# EAGLE design v2560 (EAGLE 7.6.0)
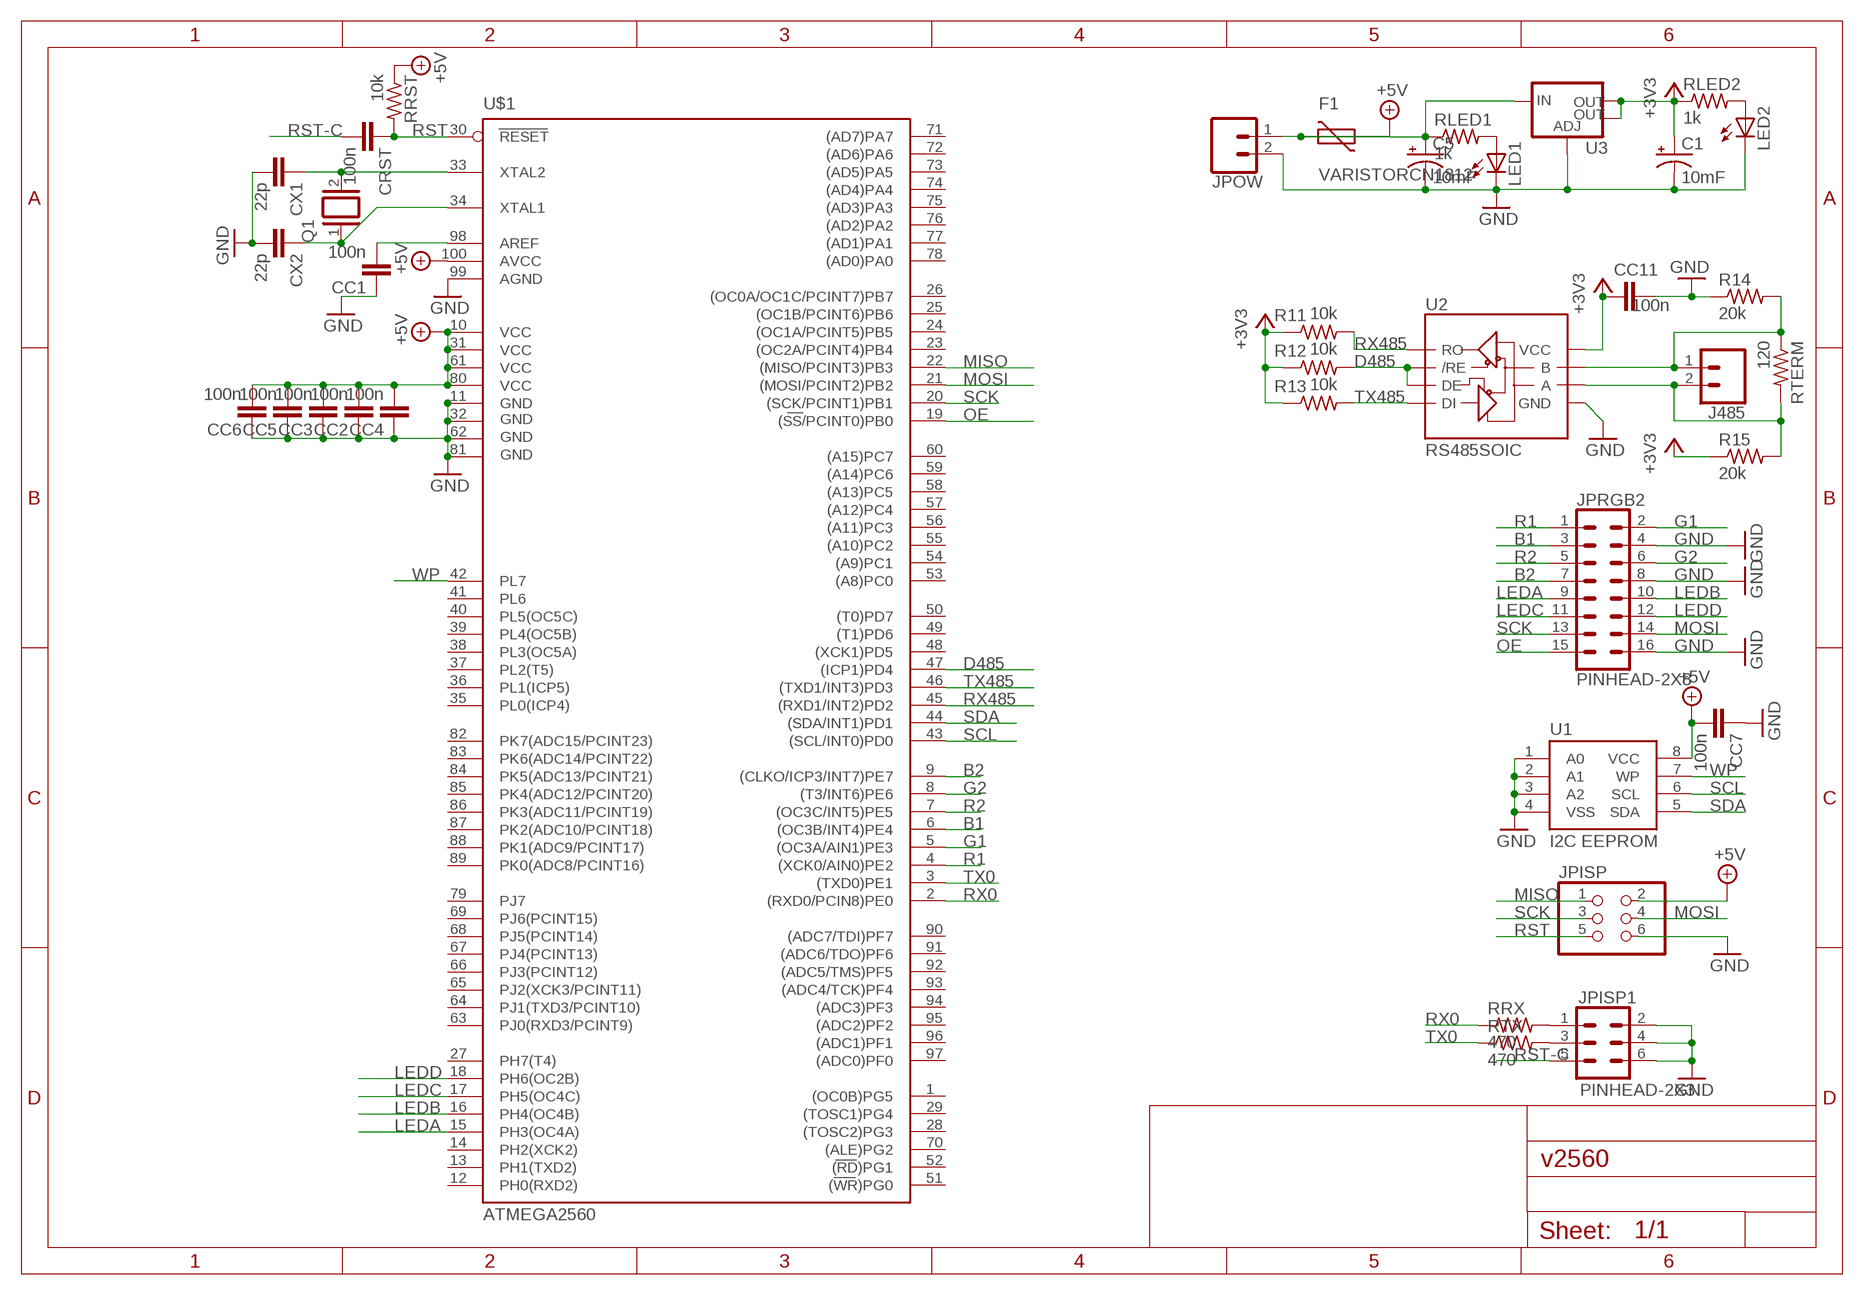
[diagram p0: schematic, sheet 1]

## Parts
C1  10mF  1000UF-RADIAL-5MM-25V-20%  [CPOL-RADIAL-5MM-10MM]
C5  10mF  1000UF-RADIAL-5MM-25V-20%  [CPOL-RADIAL-5MM-10MM]
CC1  100n  CAP-NPOL_C0805  [C0805]
CC2  100n  CAP-NPOL_C0805  [C0805]
CC3  100n  CAP-NPOL_C0805  [C0805]
CC4  100n  CAP-NPOL_C0805  [C0805]
CC5  100n  CAP-NPOL_C0805  [C0805]
CC6  100n  CAP-NPOL_C0805  [C0805]
CC7  100n  CAP-NPOL_C0805  [C0805]
CC11  100n  CAP-NPOL_C0805  [C0805]
CRST  100n  CAP-NPOL_C0805  [C0805]
CX1  22p  CAP-NPOL_C0805  [C0805]
CX2  22p  CAP-NPOL_C0805  [C0805]
F1  VARISTORCN1812  [CT/CN1812]
J485  CONN_025MM  [SCREWTERMINAL-5MM-2]
JPISP  PINHD-2X3  [2X03]
JPISP1  PINHEAD-2X3  [2X03-LOCK]
JPOW  CONN_025MM  [SCREWTERMINAL-5MM-2]
JPRGB2  PINHEAD-2X8  [2X08-LOCK]
LED1  LED3MM  [LED3MM]
LED2  LED3MM  [LED3MM]
Q1  XTAL/S  [QS]
R11  10k  RES_R0805  [R0805]
R12  10k  RES_R0805  [R0805]
R13  10k  RES_R0805  [R0805]
R14  20k  RES_TH3  [RES-0.3]
R15  20k  RES_TH3  [RES-0.3]
RLED1  1k  RES_R0805  [R0805]
RLED2  1k  RES_R0805  [R0805]
RRST  10k  RES_R0805  [R0805]
RRX  470  RES_R0805  [R0805]
RTERM  120  RES_R0805  [R0805]
RTX  470  RES_R0805  [R0805]
U1  I2C EEPROM  EEPROM-I2CEIAJ  [SO08-EIAJ]
U2  RS485SOIC  [SO08]
U3  V_REG_LM1117SOT223  [SOT223]
U$1  ATMEGA2560  [TQFP100]

## Nets
+3V3: C1.+ CC11.2 R11.1 R12.1 R13.1 R15.1 RLED2.1 U2.8(VCC) U3.2(OUT) U3.4(OUT)
+5V: C5.+ CC2.2 CC3.2 CC4.2 CC5.2 CC6.2 CC7.2 F1.2 JPISP.2 RLED1.1 RRST.1 U1.8(VCC) U3.3(IN) U$1.10(VCC) U$1.31(VCC1) U$1.61(VCC2) U$1.80(VCC3) U$1.100(AVCC)
AREF: CC1.2 U$1.98(AREF)
B1: JPRGB2.3 U$1.6((OC3B/INT4)PE4)
B2: JPRGB2.7 U$1.9((CLKO/ICP3/INT7)PE7)
D485: R12.2 U2.2(/RE) U2.3(DE) U$1.47((ICP1)PD4)
G1: JPRGB2.2 U$1.5((OC3A/AIN1)PE3)
G2: JPRGB2.6 U$1.8((T3/INT6)PE6)
GND: C1.- C5.- CC1.1 CC2.1 CC3.1 CC4.1 CC5.1 CC6.1 CC7.1 CC11.1 CX1.2 CX2.2 JPISP1.2 JPISP1.4 JPISP1.6 JPISP.6 JPOW.2 JPRGB2.4 JPRGB2.8 JPRGB2.16 LED1.K(C) LED2.K(C) R14.1 U1.1(A0) U1.2(A1) U1.3(A2) U1.4(VSS) U2.5(GND) U3.1(ADJ) U$1.11(GND) U$1.32(GND1) U$1.62(GND2) U$1.81(GND3) U$1.99(AGND)
LEDA: JPRGB2.9 U$1.15(PH3(OC4A))
LEDB: JPRGB2.10 U$1.16(PH4(OC4B))
LEDC: JPRGB2.11 U$1.17(PH5(OC4C))
LEDD: JPRGB2.12 U$1.18(PH6(OC2B))
MISO: JPISP.1 U$1.22((MISO/PCINT3)PB3)
MOSI: JPISP.4 JPRGB2.14 U$1.21((MOSI/PCINT2)PB2)
N$2: J485.2 R15.2 RTERM.2 U2.6(A)
N$5: CX1.1 Q1.2 U$1.33(XTAL2)
N$6: CX2.1 Q1.1 U$1.34(XTAL1)
N$8: LED1.A RLED1.2
N$10: LED2.A RLED2.2
N$11: J485.1 R14.2 RTERM.1 U2.7(B)
N$12: F1.1 JPOW.1
N$14: JPISP1.3 RTX.2
N$15: JPISP1.1 RRX.2
OE: JPRGB2.15 U$1.19((SS/PCINT0)PB0)
R1: JPRGB2.1 U$1.4((XCK0/AIN0)PE2)
R2: JPRGB2.5 U$1.7((OC3C/INT5)PE5)
RST: CRST.1 JPISP.5 RRST.2 U$1.30(RESET)
RST-C: CRST.2 JPISP1.5
RX0: RRX.1 U$1.2((RXD0/PCIN8)PE0)
RX485: R11.2 U2.1(RO) U$1.45((RXD1/INT2)PD2)
SCK: JPISP.3 JPRGB2.13 U$1.20((SCK/PCINT1)PB1)
SCL: U1.6(SCL) U$1.43((SCL/INT0)PD0)
SDA: U1.5(SDA) U$1.44((SDA/INT1)PD1)
TX0: RTX.1 U$1.3((TXD0)PE1)
TX485: R13.2 U2.4(DI) U$1.46((TXD1/INT3)PD3)
WP: U1.7(WP) U$1.42(PL7)
Unconnected: U$1.1((OC0B)PG5) U$1.12(PH0(RXD2)) U$1.13(PH1(TXD2)) U$1.14(PH2(XCK2)) U$1.23((OC2A/PCINT4)PB4) U$1.24((OC1A/PCINT5)PB5) U$1.25((OC1B/PCINT6)PB6) U$1.26((OC0A/OC1C/PCINT7)PB7) U$1.27(PH7(T4)) U$1.28((TOSC2)PG3) U$1.29((TOSC1)PG4) U$1.35(PL0(ICP4)) U$1.36(PL1(ICP5)) U$1.37(PL2(T5)) U$1.38(PL3(OC5A)) U$1.39(PL4(OC5B)) U$1.40(PL5(OC5C)) U$1.41(PL6) U$1.48((XCK1)PD5) U$1.49((T1)PD6) U$1.50((T0)PD7) U$1.51((WR)PG0) U$1.52((RD)PG1) U$1.53((A8)PC0) U$1.54((A9)PC1) U$1.55((A10)PC2) U$1.56((A11)PC3) U$1.57((A12)PC4) U$1.58((A13)PC5) U$1.59((A14)PC6) U$1.60((A15)PC7) U$1.63(PJ0(RXD3/PCINT9)) U$1.64(PJ1(TXD3/PCINT10)) U$1.65(PJ2(XCK3/PCINT11)) U$1.66(PJ3(PCINT12)) U$1.67(PJ4(PCINT13)) U$1.68(PJ5(PCINT14)) U$1.69(PJ6(PCINT15)) U$1.70((ALE)PG2) U$1.71((AD7)PA7) U$1.72((AD6)PA6) U$1.73((AD5)PA5) U$1.74((AD4)PA4) U$1.75((AD3)PA3) U$1.76((AD2)PA2) U$1.77((AD1)PA1) U$1.78((AD0)PA0) U$1.79(PJ7) U$1.82(PK7(ADC15/PCINT23)) U$1.83(PK6(ADC14/PCINT22)) U$1.84(PK5(ADC13/PCINT21)) U$1.85(PK4(ADC12/PCINT20)) U$1.86(PK3(ADC11/PCINT19)) U$1.87(PK2(ADC10/PCINT18)) U$1.88(PK1(ADC9/PCINT17)) U$1.89(PK0(ADC8/PCINT16)) U$1.90((ADC7/TDI)PF7) U$1.91((ADC6/TDO)PF6) U$1.92((ADC5/TMS)PF5) U$1.93((ADC4/TCK)PF4) U$1.94((ADC3)PF3) U$1.95((ADC2)PF2) U$1.96((ADC1)PF1) U$1.97((ADC0)PF0)

## Library data of the parts
C1 C5 = SparkFun-Capacitors:1000UF: 1,000µF/1mF ceramic capacitors A capacitor is a passive two-terminal electrical component used to store electrical energy temporarily in an electric field. CAP-08070; PROD_ID: CAP-09538; VALUE: 1mF
CC1-CC7 CC11 CRST CX1 CX2 = edes_lib_160827:CAP-NPOL
F1 = varistor:VARISTOR: VARISTOR
J485 JPOW = SparkFun-Connectors:CONN_02: Multi connection point. Often used as Generic Header-pin footprint for 0.1 inch spaced/style header connections On any of the 0.1 inch spaced packages, you can populate with these: Break Away Headers - Straight <https://www.sparkfun.com/products/116> (PRT-00116) Break Away Male Headers - Right Angle <https://www.sparkfun.com/products/553> (PRT-00553) Female Headers <https://www.sparkfun.com/products/115> (PRT-00115) Break Away Headers - Machine Pin <https://www.sparkfun.com/products/117> (PRT-00117) Break Away Female Headers - Swiss Machine Pin <https://www.sparkfun.com/products/743> (PRT-00743) For SCREWTERMINALS and SPRING TERMINALS visit here: Screw Terimnals on SparkFun.com <https://www.sparkfun.com/search/results?term=Screw+Terminals> (5mm/3.5mm/2.54mm spacing) This device is also useful as a general connection point to wire up your design to another part of your project. Our various solder wires solder well into these plated through hole pads. Hook-Up Wire - Assortment (Stranded, 22 AWG) <https://www.sparkfun.com/products/11375> (PRT-11375) Hook-Up Wire - Assortment (Solid Core, 22 AWG) <https://www.sparkfun.com/products/11367> (PRT-11367) View the entire wire category on our website here <https://www.sparkfun.com/categories/141> Special notes: Molex polarized connector foot print use with: PRT-08233 with associated crimp pins and housings. 2.54_SCREWTERM for use with PRT-10571. 3.5mm Screw Terminal footprints for PRT-08084 5mm Screw Terminal footprints for use with PRT-08432; SF_SKU: PRT-08432
JPISP = pinhead:PINHD-2X3: PIN HEADER
JPISP1 = edes_lib_160827:PINHEAD-2X3
JPRGB2 = edes_lib_160827:PINHEAD-2X8
LED1 LED2 = edes_lib_160827:LED: LED OSRAM: - CHIPLED LG R971, LG N971, LY N971, LG Q971, LY Q971, LO R971, LY R971 LH N974, LH R974 LS Q976, LO Q976, LY Q976 LO Q996 - Hyper CHIPLED LW Q18S LB Q993, LB Q99A, LB R99A - SideLED LS A670, LO A670, LY A670, LG A670, LP A670 LB A673, LV A673, LT A673, LW A673 LH A674 LY A675 LS A676, LA A676, LO A676, LY A676, LW A676 LS A679, LY A679, LG A679 - Hyper Micro SIDELED® LS Y876, LA Y876, LO Y876, LY Y876 LT Y87S - SmartLED LW L88C, LW L88S LB L89C, LB L89S, LG L890 LS L89K, LO L89K, LY L89K LS L896, LA L896, LO L896, LY L896 - TOPLED LS T670, LO T670, LY T670, LG T670, LP T670 LSG T670, LSP T670, LSY T670, LOP T670, LYG T670 LG T671, LOG T671, LSG T671 LB T673, LV T673, LT T673, LW T673 LH T674 LS T676, LA T676, LO T676, LY T676, LB T676, LH T676, LSB T676, LW T676 LB T67C, LV T67C, LT T67C, LS T67K, LO T67K, LY T67K, LW E67C LS E67B, LA E67B, LO E67B, LY E67B, LB E67C, LV E67C, LT E67C LW T67C LS T679, LY T679, LG T679 LS T770, LO T770, LY T770, LG T770, LP T770 LB T773, LV T773, LT T773, LW T773 LH T774 LS E675, LA E675, LY E675, LS T675 LS T776, LA T776, LO T776, LY T776, LB T776 LHGB T686 LT T68C, LB T68C - Hyper Mini TOPLED® LB M676 - Mini TOPLED Santana® LG M470 LS M47K, LO M47K, LY M47K Source: http://www.osram.convergy.de LUXEON: - LUMILED® LXK2-PW12-R00, LXK2-PW12-S00, LXK2-PW14-U00, LXK2-PW14-V00 LXK2-PM12-R00, LXK2-PM12-S00, LXK2-PM14-U00 LXK2-PE12-Q00, LXK2-PE12-R00, LXK2-PE12-S00, LXK2-PE14-T00, LXK2-PE14-U00 LXK2-PB12-K00, LXK2-PB12-L00, LXK2-PB12-M00, LXK2-PB14-N00, LXK2-PB14-P00, LXK2-PB14-Q00 LXK2-PR12-L00, LXK2-PR12-M00, LXK2-PR14-Q00, LXK2-PR14-R00 LXK2-PD12-Q00, LXK2-PD12-R00, LXK2-PD12-S00 LXK2-PH12-R00, LXK2-PH12-S00 LXK2-PL12-P00, LXK2-PL12-Q00, LXK2-PL12-R00 Source: www.luxeon.com KINGBRIGHT: KA-3528ASYC Source: www.kingbright.com
Q1 = special:XTAL/S: CRYSTAL
R11-R15 RLED1 RLED2 RRST RRX RTERM RTX = edes_lib_160827:RES
U1 = SparkFun-IC-Memory:EEPROM-I2C: I2C EEPROMs, 24LC256 and others 24LC256 Series 256 kb I2C 2 Wire (32 k x 8 Bit) 2.5 V Serial EEPROM SMD - SOIC-8 Datasheet SparkFun Products SparkFun UDB5 - PIC UAV Development Board <https://www.sparkfun.com/products/11703> (GPS-11703); PROD_ID: NA-XXXXX
U2 = SparkFun-DigitalIC:RS485: RS485 transceiver
U3 = SparkFun-IC-Power:V_REG_LM1117: Voltage Regulator LM1117 Standard adjustable voltage regulator but in SMD form. Spark Fun Electronics SKU : COM-00595; PROD_ID: VREG-08170
U$1 = edes_lib_160827:ATMEGA2560

## Board
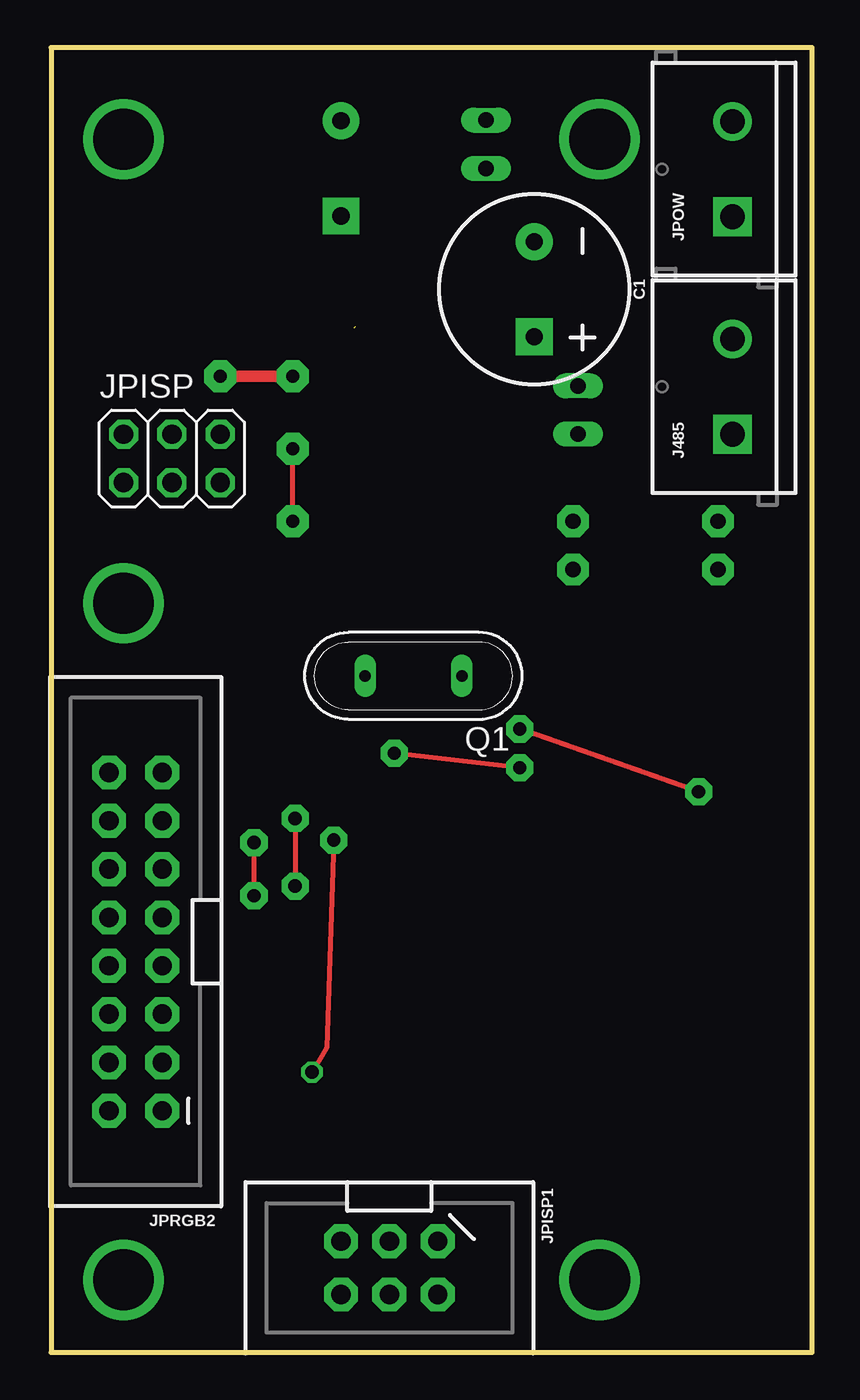
[diagram p1: board, top side]
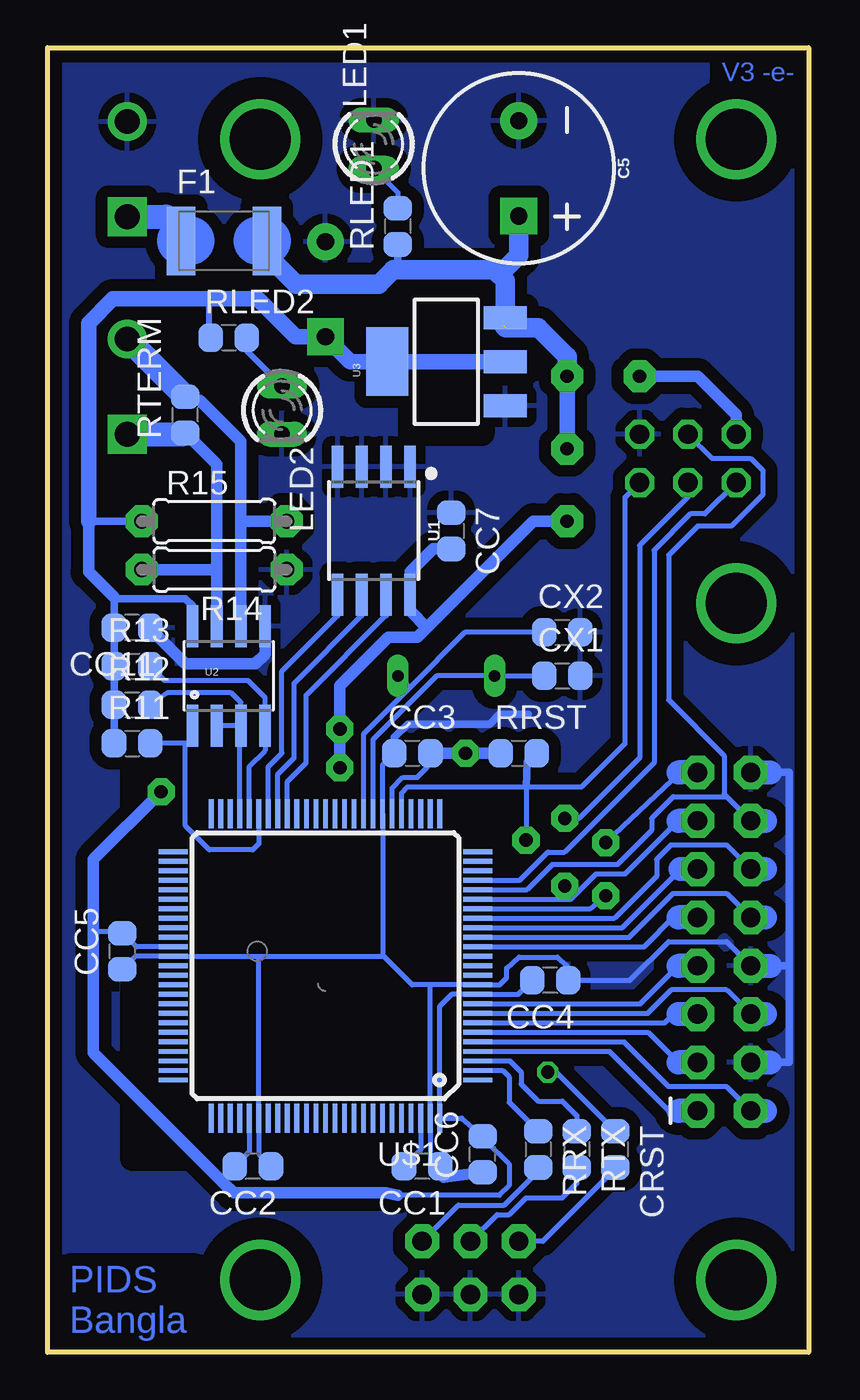
[diagram p2: board, bottom side, seen from below]

Size 40.01 x 68.58 mm. Coordinates in mm from the lower left corner, seen from the top.
Outline: 0,0 40.01,0 40.01,68.58 0,68.58 0,0
Copper layers (1*16): Top 0.035mm / dielectric 1.5mm / Bottom 0.035mm
Design rules "default *": minimum track width 10mil, minimum drill 24mil, track to track 9.5mil, track to pad 9.5mil, pad to pad 9.5mil, via to via 9.5mil, smd to smd 8mil, copper to edge 10mil, drill to drill 8mil, minimum pad ring 10mil, minimum via ring 8mil, stop-mask expansion 4mil, vias tented up to drill 0mil, thermal gap 20mil
bRestrict: area 1.3,1.3 to 6.3,6.3; area 26.3,1.3 to 31.3,6.3; area 1.3,61.3 to 6.3,66.3; area 26.3,61.3 to 31.3,66.3; area 15.2,10.2 to 35.6,30.5; area 17.1,48.3 to 21,54.9; area 1.3,36.9 to 6.3,41.9

### Footprints (pad centres in the part's own frame; a part is rotated, then mirrored left to right if it is on the bottom)
CPOL-RADIAL-5MM-10MM = drill 0.9 pad 1.93 square: + 2.5,0 | drill 0.9 pad 1.93: - -2.5,0
C0805 = smd 1.3 x 1.5: 1 -0.95,0; 2 0.95,0
CT/CN1812 = smd 1.5 x 3.6: 1 -2.25,0; 2 2.25,0
SCREWTERMINAL-5MM-2 = drill 1.3 pad 2.032 square: 1 0,0 | drill 1.3 pad 2.032: 2 5,0
2X03 = drill 1.016 octagon: 1 -2.54,-1.27; 2 -2.54,1.27; 3 0,-1.27; 4 0,1.27; 5 2.54,-1.27; 6 2.54,1.27
2X03-LOCK = drill 1.016 pad 1.778 octagon: 1 -1.397,2.54; 2 1.397,2.54; 3 -1.397,0; 4 1.397,0; 5 -1.397,-2.54; 6 1.397,-2.54
2X08-LOCK = drill 1.016 pad 1.778 octagon: 1 -1.397,8.89; 2 1.397,8.89; 3 -1.397,6.35; 4 1.397,6.35; 5 -1.397,3.81; 6 1.397,3.81; 7 -1.397,1.27; 8 1.397,1.27; 9 -1.397,-1.27; 10 1.397,-1.27; 11 -1.397,-3.81; 12 1.397,-3.81; 13 -1.397,-6.35; 14 1.397,-6.35; 15 -1.397,-8.89; 16 1.397,-8.89
LED3MM = drill 0.813 pad 1.016 long: A -1.27,0; K 1.27,0
QS = drill 0.61 long: 1 -2.54,0; 2 2.54,0
R0805 = smd 1.3 x 1.5: 1 -0.95,0; 2 0.95,0
RES-0.3 = drill 0.8 pad 1.676 octagon: 1 -3.81,0; 2 3.81,0
SO08-EIAJ = smd 0.61 x 2.21: 1 -1.905,-3.378; 2 -0.635,-3.378; 3 0.635,-3.378; 4 1.905,-3.378; 5 1.905,3.353; 6 0.635,3.353; 7 -0.635,3.353; 8 -1.905,3.353
SO08 = smd 0.61 x 2.21: 1 -1.905,-2.616; 2 -0.635,-2.616; 3 0.635,-2.616; 4 1.905,-2.616; 5 1.905,2.616; 6 0.635,2.616; 7 -0.635,2.616; 8 -1.905,2.616
SOT223 = smd 1.219 x 2.235: 1 -2.311,-3.099; 2 0,-3.099; 3 2.311,-3.099 | smd 3.6 x 2.2: 4 0,3.099
TQFP100 = smd 1.524 x 0.254: 1 -8,6; 2 -8,5.5; 3 -8,5; 4 -8,4.5; 5 -8,4; 6 -8,3.5; 7 -8,3; 8 -8,2.5; 9 -8,2; 10 -8,1.5; 11 -8,1; 12 -8,0.5; 13 -8,0; 14 -8,-0.5; 15 -8,-1; 16 -8,-1.5; 17 -8,-2; 18 -8,-2.5; 19 -8,-3; 20 -8,-3.5; 21 -8,-4; 22 -8,-4.5; 23 -8,-5; 24 -8,-5.5; 25 -8,-6; 51 8,-6; 52 8,-5.5; 53 8,-5; 54 8,-4.5; 55 8,-4; 56 8,-3.5; 57 8,-3; 58 8,-2.5; 59 8,-2; 60 8,-1.5; 61 8,-1; 62 8,-0.5; 63 8,0; 64 8,0.5; 65 8,1; 66 8,1.5; 67 8,2; 68 8,2.5; 69 8,3; 70 8,3.5; 71 8,4; 72 8,4.5; 73 8,5; 74 8,5.5; 75 8,6 | smd 0.254 x 1.524: 26 -6,-8; 27 -5.5,-8; 28 -5,-8; 29 -4.5,-8; 30 -4,-8; 31 -3.5,-8; 32 -3,-8; 33 -2.5,-8; 34 -2,-8; 35 -1.5,-8; 36 -1,-8; 37 -0.5,-8; 38 0,-8; 39 0.5,-8; 40 1,-8; 41 1.5,-8; 42 2,-8; 43 2.5,-8; 44 3,-8; 45 3.5,-8; 46 4,-8; 47 4.5,-8; 48 5,-8; 49 5.5,-8; 50 6,-8; 76 6,8; 77 5.5,8; 78 5,8; 79 4.5,8; 80 4,8; 81 3.5,8; 82 3,8; 83 2.5,8; 84 2,8; 85 1.5,8; 86 1,8; 87 0.5,8; 88 0,8; 89 -0.5,8; 90 -1,8; 91 -1.5,8; 92 -2,8; 93 -2.5,8; 94 -3,8; 95 -3.5,8; 96 -4,8; 97 -4.5,8; 98 -5,8; 99 -5.5,8; 100 -6,8

### Placement (x,y rotation side)
C1  25.4,55.88 270 top
C5  15.24,62.23 270 bottom
CC1  20.32,9.78 180 bottom
CC2  29.21,9.78 180 bottom
CC3  20.83,31.5 0 bottom
CC4  13.59,19.56 180 bottom
CC5  36.07,21.08 90 bottom
CC6  17.14,10.41 90 bottom
CC7  18.8,43.18 270 bottom
CC11  35.56,38.1 180 bottom
CRST  10.16,10.67 270 bottom
CX1  12.95,35.56 0 bottom
CX2  12.95,37.85 0 bottom
F1  30.73,58.42 0 bottom
J485  35.81,48.26 90 top
JPISP  6.35,46.99 0 top
JPISP1  17.78,4.45 270 top
JPOW  35.81,59.69 90 top
JPRGB2  4.45,21.59 180 top
LED1  22.86,63.5 90 bottom
LED2  27.69,49.53 270 bottom
Q1  19.05,35.56 180 top
R11  35.56,32 0 bottom
R12  35.56,34.04 0 bottom
R13  35.56,36.07 0 bottom
R14  31.24,41.15 180 bottom
R15  31.24,43.69 0 bottom
RLED1  21.59,59.18 90 bottom
RLED2  30.48,53.34 0 bottom
RRST  15.24,31.5 0 bottom
RRX  14.22,10.67 270 bottom
RTERM  32.77,49.28 90 bottom
RTX  12.19,10.67 270 bottom
U1  22.86,43.18 180 bottom
U2  30.48,35.56 0 bottom
U3  19.05,52.07 90 bottom
U$1  25.4,20.32 180 bottom

### Tracks (layer width: path | path; a pad name or v marks a point on that pad's centre or on a via)
+3V3
  Bottom 0.305: RLED2.1 31.5,53.34 31.5,55.37
  Bottom 0.406: U2.8 32.38,39.24 32.77,39.62 36.44,39.62 36.51,39.69 CC11.2 R13.1 R12.1 R11.1 | R15.1 37.85,43.69
  Bottom 0.61: 37.85,43.69 37.85,41.03 36.51,39.69
  Bottom 0.813: 37.85,43.69 37.85,54.1 36.58,55.37 31.5,55.37 28.96,55.37 26.96,53.38 C1.+ 24.09,52.07 U3.4 U3.2
+5V  (via drill 0.7 pad 1.42, 0.7 pad 1.68)  (1 unrouted)
  Top 0.254: v34.04,29.46 v24.64,32.77 | v24.64,30.73 v18.03,31.5 | v12.7,43.69 v12.7,47.5
  Top 0.61: v8.89,51.31 v12.7,51.31
  Bottom 0.254: CC4.2 15.28,18.82 U$1.10 18.77,18.82 19.4,18.19 U$1.100 18.23,12.32 CC6.2 16.95,11.11 15.75,9.91 15.75,8.76 16.26,8.26 21.59,8.26 | U$1.31 21.9,29.66 21.34,30.23 20.57,30.23 20.07,30.73 20.07,31.31 CC3.2 | U$1.61 35.36,21.32 CC5.2 | U$1.80 29.4,10.54 CC2.2 | CC5.2 36.26,21.84 | CC5.2 36.13,22.1 37.59,22.1
  Bottom 0.406: CC3.2 19.56,31.5 | RRST.1 16.32,31.43 | CC2.2 30.73,9.21 30.73,8.89 | RLED1.1 21.59,56.9
  Bottom 0.61: v24.64,30.73 v24.64,32.77 24.64,35.05 22.1,37.59 20.57,37.59 20.07,38.1 | v34.04,29.46 37.59,25.91 37.59,22.1 37.59,15.75 30.73,8.89 30.23,8.38 22.23,8.38 21.59,8.26 | CC7.2 19.75,42.23 20.95,41.02 U1.8 20.95,38.99 20.07,38.1 | 20.07,38.1 14.48,43.69 v12.7,43.69 | JPISP.2 3.81,49.28 5.84,51.31 v8.89,51.31 | 16.32,31.43 16.39,31.5 v18.03,31.5 19.56,31.5
  Bottom 0.813: v12.7,51.31 v12.7,47.5
  Bottom 1.016: 15.93,53.85 14.22,53.85 12.7,52.32 v12.7,51.31 | 16,53.92 U3.3 15.95,56.34 16.26,56.64 | C5.+ 15.24,57.66 16.26,56.64 | 16.26,56.64 16.51,56.9 21.59,56.9 21.84,56.9 22.61,56.13 26.92,56.13 28.48,57.69 F1.2
  Bottom 2.54: F1.2 28.96,58.42
AREF
  Bottom 0.254: U$1.98 20.4,10.65 CC1.2
B1
  Bottom 0.254: U$1.6 8.44,16.82 6.86,15.24
  Bottom 1.27: JPRGB2.3 6.86,15.24
B2
  Bottom 0.254: U$1.9 8.86,18.32 6.86,20.32
  Bottom 1.27: JPRGB2.7 6.86,20.32
D485
  Bottom 0.254: U2.3 29.84,34.16 30.35,34.67 33.72,34.67 R12.2 | U$1.47 29.9,32.89 U2.3 | U2.3 U2.2
G1
  Bottom 0.254: U$1.5 9.72,16.32 7.37,13.97 4.32,13.97 JPRGB2.2
  Bottom 1.27: JPRGB2.2 2.29,12.7
G2
  Bottom 0.254: U$1.8 8.47,17.82 7.24,19.05 4.32,19.05 JPRGB2.6
  Bottom 1.27: JPRGB2.6 2.29,17.78
GND
  Bottom 0.254: CC1.1 19.9,9.93 U$1.99 19.9,19.23 19.81,19.32 | 17.08,9.27 CC6.1 | CC3.1 22.4,30.87 U$1.32 22.4,20.88 22.35,20.83 22.36,20.82 | 28.96,20.82 U$1.62 35.38,20.82 CC5.1 | 28.96,20.82 22.36,20.82 | 28.96,20.82 28.9,20.76 U$1.81 28.9,10.42 CC2.1 | 19.81,19.32 U$1.11 16.24,19.32 15.88,19.68 15.88,20.19 15.24,20.78 13.21,20.78 12.7,20.32 12.7,19.62 CC4.1 9.4,19.56 7.37,21.59 4.32,21.59 JPRGB2.8 | 19.81,19.32 20.84,19.32 22.34,20.82 22.36,20.82
  Bottom 0.406: CC3.1 21.78,32.32 21.08,33.02 16.76,33.02 16.26,33.53 14.73,33.53 | CC1.1 19.24,9.71 | JPRGB2.16 1.02,30.48 1.02,20.32 | 1.02,20.32 1.02,15.24 2.54,15.24 | JPRGB2.8 1.02,20.32
  Bottom 0.61: CC6.1 19.18,9.21 CC1.1 | 28.57,37.97 U2.5 28.57,36.7 29.08,36.2 32.77,36.2 34.61,38.04 CC11.1
  Bottom 1.27: JPRGB2.16 2.03,30.48 | JPRGB2.8 2.03,20.32 | JPRGB2.4 2.54,15.24 2.03,15.24
  pour Bottom (isolate 0.635): 0,68.83 40.13,68.83 40.13,0.25 40.13,0 0,0
LEDA
  Bottom 0.254: U$1.15 8.65,21.32 7.11,22.86 6.86,22.86
  Bottom 1.27: JPRGB2.9 6.86,22.86
LEDB
  Bottom 0.254: U$1.16 9.42,21.82 7.11,24.13 4.32,24.13 JPRGB2.10
  Bottom 1.27: JPRGB2.10 2.29,22.86
LEDC
  Bottom 0.254: U$1.17 9.81,22.32 6.73,25.4
  Bottom 1.27: JPRGB2.11 6.73,25.4
LEDD
  Bottom 0.254: U$1.18 10.2,22.82 8,25.02 8,25.91 7.24,26.67 4.32,26.67 JPRGB2.12
  Bottom 1.27: JPRGB2.12 2.29,25.4
MISO
  Bottom 0.254: U$1.22 15.19,24.82 13.72,26.29 12.83,26.29 8.13,30.99 8.13,42.16 6.22,44.07 5.46,44.07 JPISP.1
MOSI
  Bottom 0.254: 4.32,29.21 7.11,29.21 8.26,28.07 8.26,27.43 10.03,25.65 13.46,25.65 14.8,24.32 U$1.21 | 4.32,29.21 4.45,29.34 4.45,31.37 7.37,34.29 7.37,41.91 5.84,43.43 4.06,43.43 2.41,45.09 2.41,46.35 3.05,46.99 5.08,46.99 JPISP.4 | 4.32,29.21 JPRGB2.14
  Bottom 1.27: JPRGB2.14 2.29,27.94
N$2
  Bottom 0.61: U2.6 29.84,43.69 | 29.84,43.69 29.84,47.88 32,50.04 32.58,50.04 RTERM.2 | R15.2 29.84,43.69
  Bottom 1.27: J485.2 RTERM.2
N$3  (via drill 3.2)
  other vias: 3.81,3.81
N$4  (via drill 3.2)
  other vias: 28.83,3.81
N$5
  Bottom 0.254: U$1.33 22.9,32.22 19.56,35.56 Q1.2 CX1.1
N$6
  Bottom 0.254: U$1.34 23.4,32.51 20.97,34.94 | 20.97,34.94 18.07,37.85 CX2.1 | Q1.1 20.97,34.94
N$7  (via drill 3.2)
  other vias: 3.81,39.37
N$8
  Bottom 0.254: LED1.A 21.59,60.96 RLED1.2
N$9  (via drill 3.2)
  other vias: 28.83,63.75
N$10
  Bottom 0.305: LED2.A 29.53,52.64 RLED2.2
N$11
  Bottom 0.61: U2.7 31.11,41.15 | 31.11,41.15 31.11,46.67 RTERM.1 | R14.2 31.11,41.15
  Bottom 1.27: J485.1 32.83,48.26 RTERM.1
N$12
  Bottom 1.27: JPOW.1 33.78,59.69 33.02,58.93 33.02,58.46 F1.1
  Bottom 2.54: F1.1 32.51,58.42
N$14
  Bottom 0.254: JPISP1.3 16.38,7.24 15.75,7.24 14.86,8.13 12.95,8.13 12.19,8.89 RTX.2
N$15
  Bottom 0.254: JPISP1.1 18.41,7.75 16,7.75 14.22,9.53 RRX.2
N$18  (via drill 3.2)
  other vias: 3.81,63.75
OE  (via drill 0.7 pad 1.42)
  Top 0.254: v10.67,24 v10.67,26.8
  Bottom 0.254: U$1.19 11.48,23.32 v10.67,24 | 10.92,26.42 v10.67,26.8 6.73,30.48
  Bottom 1.27: JPRGB2.15 6.73,30.48 6.86,30.48
R1
  Bottom 0.254: U$1.4 10.49,15.82 7.37,12.7 6.86,12.7
  Bottom 1.27: JPRGB2.1 6.86,12.7
R2
  Bottom 0.254: U$1.7 7.57,17.32 7.11,17.78 6.86,17.78
  Bottom 1.27: JPRGB2.5 6.86,17.78
RST  (via drill 0.7, 0.7 pad 1.42)
  Top 0.254: v14.86,26.92 14.48,16 v13.72,14.73
  Bottom 0.254: U$1.30 21.4,29.4 21.08,29.72 14.86,29.72 | 14.86,29.72 11.94,29.72 9.65,32 9.65,44.96 JPISP.5 | 14.86,29.72 v14.86,26.92 | v13.72,14.73 13.27,14.73 CRST.1
  Bottom 0.406: RRST.2 14.8,31.05 14.86,29.72
RST-C
  Bottom 0.254: CRST.2 10.16,9.65 13.97,5.84 JPISP1.5
RX0
  Bottom 0.254: U$1.2 16.09,14.82 15.75,14.48 15.75,13.14 RRX.1
RX485
  Bottom 0.254: U$1.45 28.9,26.73 29.21,26.42 31.5,26.42 32.77,27.69 32.77,32 | U2.1 32.38,32.13 32.77,32 | 32.77,32 R11.2
SCK  (via drill 0.7 pad 1.42)
  Top 0.254: v12.83,28.07 v12.83,24.51
  Bottom 0.254: U$1.20 13.21,23.82 | 13.21,23.82 12.5,23.82 11.18,25.15 9.65,25.15 7.11,27.69 7.11,27.94 6.86,27.94 | v12.83,24.51 13.21,23.82 | JPISP.3 6.35,44.96 8.89,42.42 8.89,31.24 12.06,28.07 v12.83,28.07
  Bottom 1.27: JPRGB2.13 6.86,27.94
SCL
  Bottom 0.254: U$1.43 27.9,30.39 27.05,31.24 27.05,35.18 23.5,38.73
  Bottom 0.305: U1.6 23.5,38.73
SDA
  Bottom 0.254: U$1.44 28.4,30.78 27.69,31.5 27.69,35.81 24.77,38.73
  Bottom 0.305: U1.5 24.77,38.73
TX0
  Bottom 0.254: U$1.3 15.7,15.32 15.11,14.73 15.11,14.1 14.22,13.21 12.95,13.21 12.19,12.45 RTX.1
TX485
  Bottom 0.254: R13.2 33.85,35.31 29.46,35.31 28.57,34.42 U2.4 28.57,31.62 29.4,30.8 U$1.46
WP
  Bottom 0.254: U$1.42 27.4,30 26.42,30.99 26.42,34.54 22.23,38.73
  Bottom 0.305: U1.7 22.23,38.73

### Text on the board
Bottom: V3 -e- | PIDS / Bangla